# EAGLE design tail (EAGLE 9.3.2)
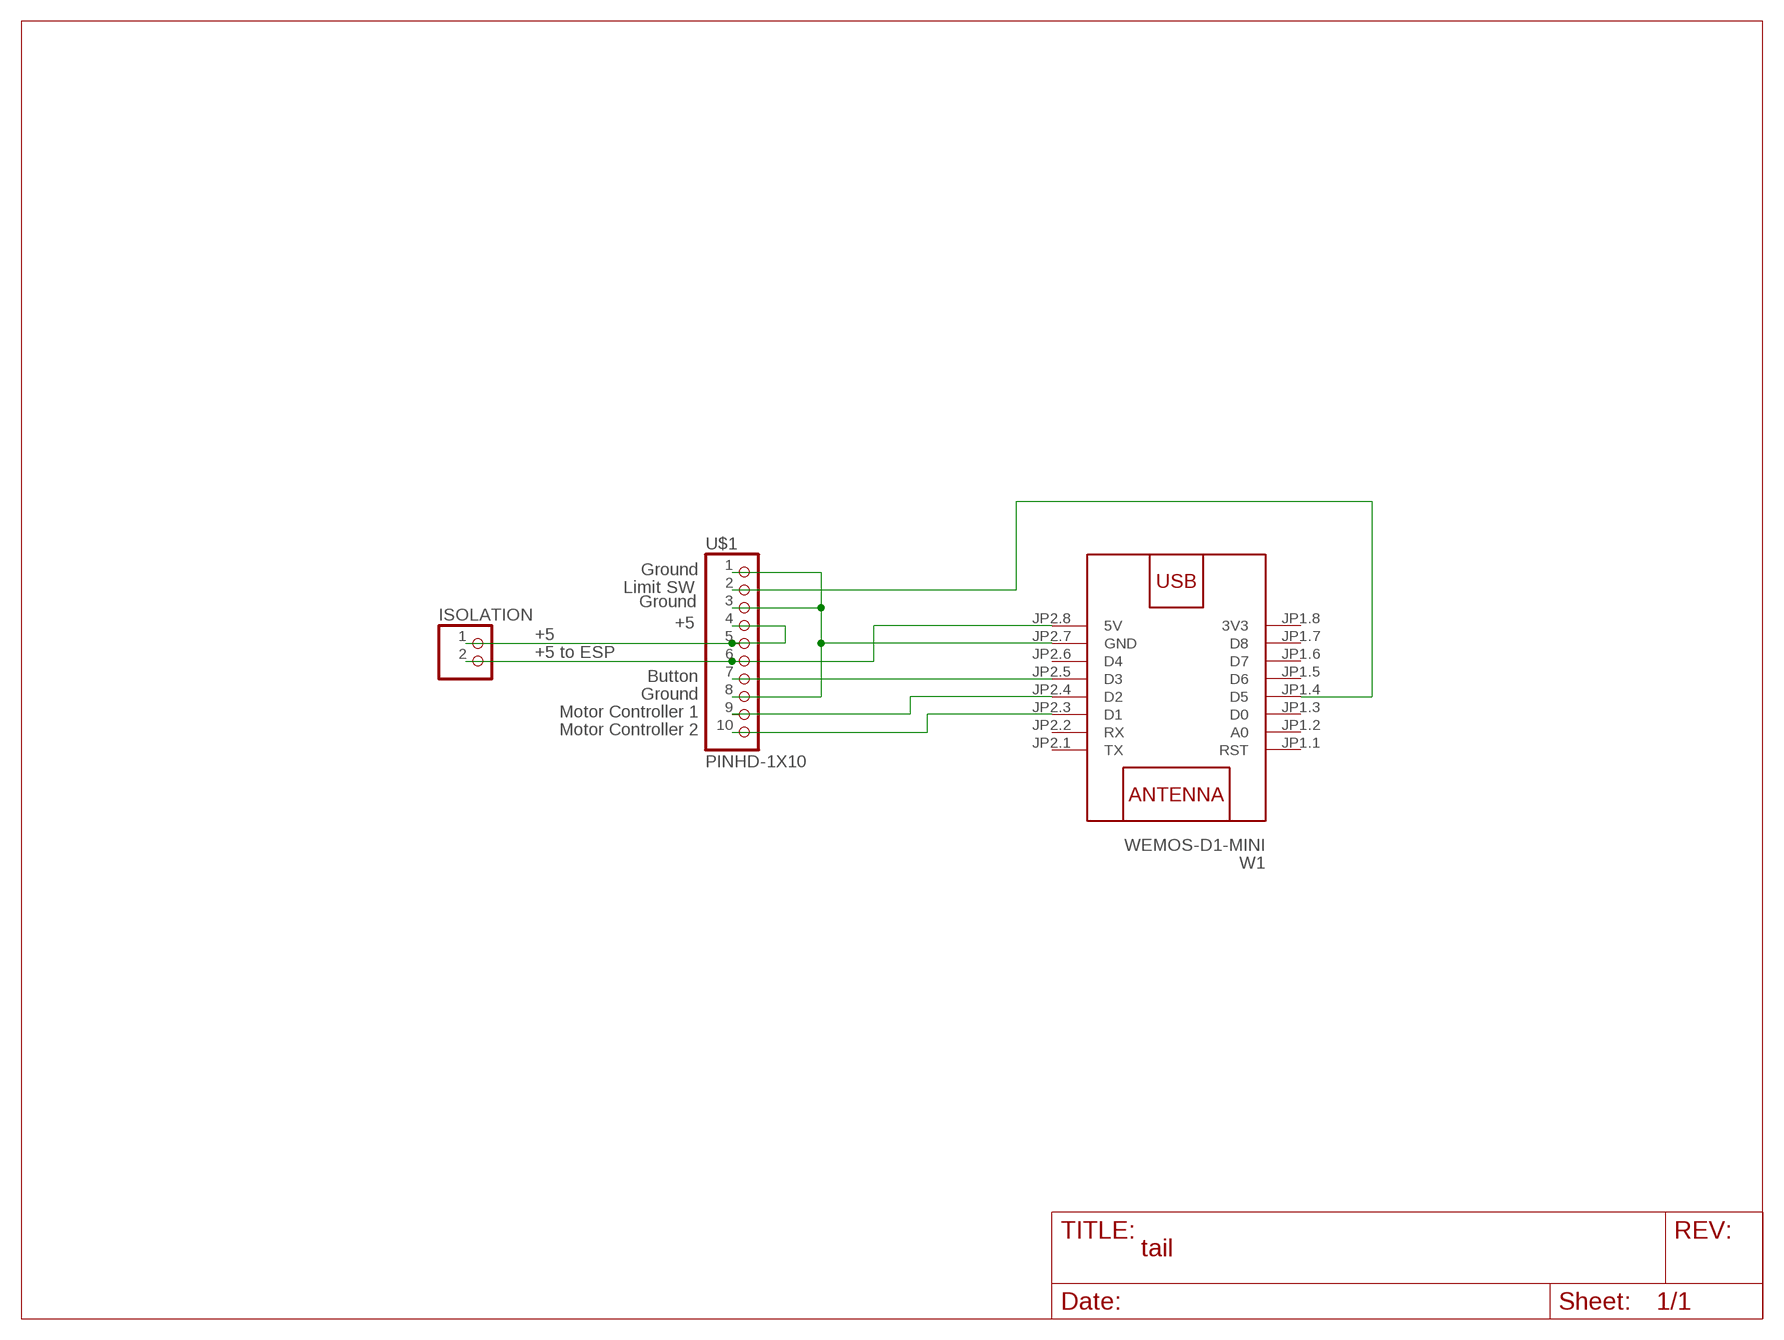
[diagram p0: schematic, sheet 1]

## Parts
ISOLATION  PINHD-1X2  [1X02]
U$1  PINHD-1X10  [1X10-BIG]
W1  WEMOS-D1-MINI  [WEMOS-D1-MINI]

## Nets
N$1: U$1.7 W1.JP2.5(D3)
N$2: U$1.9 W1.JP2.4(D2)
N$3: U$1.10 W1.JP2.3(D1)
N$4: ISOLATION.1 U$1.4 U$1.5
N$6: ISOLATION.2 U$1.6 W1.JP2.8(5V)
N$7: U$1.2 W1.JP1.4(D5)
N$8: U$1.1 U$1.3 U$1.8 W1.JP2.7(GND)
Unconnected: W1.JP1.1(RST) W1.JP1.2(A0) W1.JP1.3(D0) W1.JP1.5(D6) W1.JP1.6(D7) W1.JP1.7(D8) W1.JP2.1(TX) W1.JP2.2(RX) W1.JP2.6(D4)

## Notes on the sheet
- Ground
- Limit SW
- Ground
- +5
- +5
- +5 to ESP
- Button
- Ground
- Motor Controller 1
- Motor Controller 2

## Power pins joined to a net without a drawn wire
3V3: W1.JP1.8(3V3)

## Library data of the parts
ISOLATION = pinhead:PINHD-1X2: PIN HEADER
U$1 = adafruit:PINHD-1X10: Pin header 1x10 0.1" spacing With round pins
W1 = diy-modules:WEMOS-D1-MINI: WEMOS D1 mini: Mini Wi-Fi Board based on ESP-8266 device More details can be found here: https://www.wemos.cc/product/d1-mini.html Click here to find device on ebay.com <http://www.ebay.com/sch/wemos+d1+mini+nodemcu>

## Board
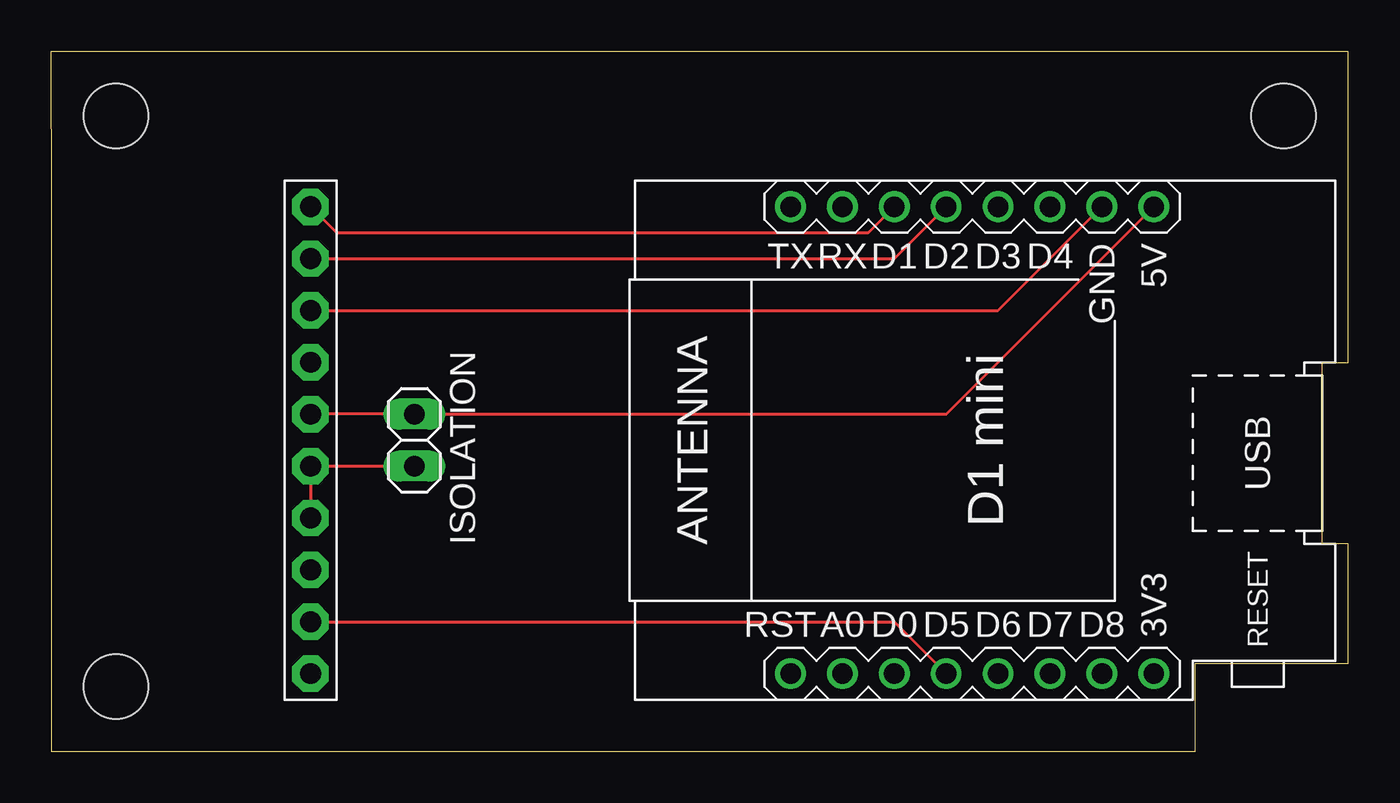
[diagram p1: board, top side]
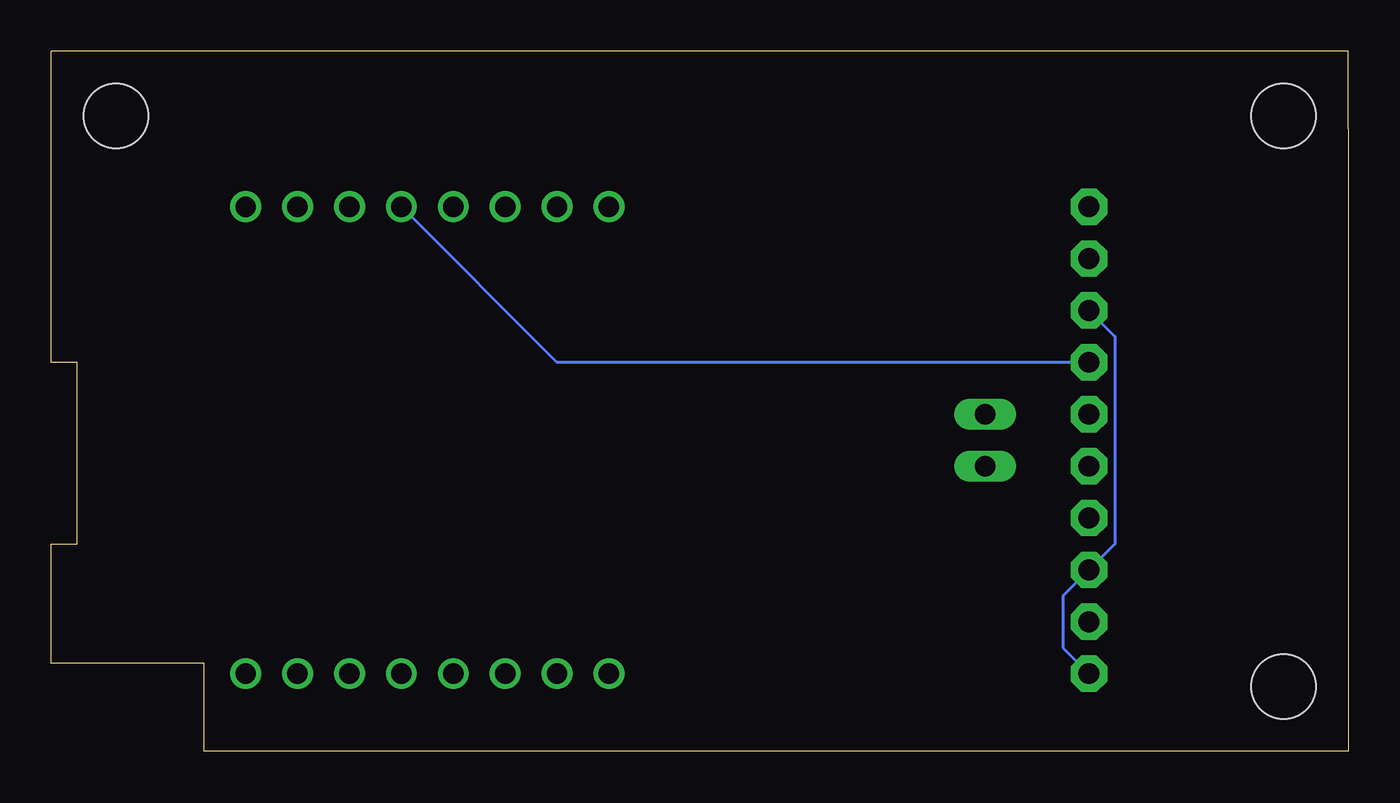
[diagram p2: board, bottom side, seen from below]

Size 63.5 x 34.29 mm. Coordinates in mm from the lower left corner, seen from the top.
Outline: 0,30.47 0,0 56.01,0 56.01,4.32 63.5,4.32 63.5,10.16 62.23,10.16 62.23,19.05 63.5,19.05 63.5,34.29 0,34.29 0,30.48
Copper layers (1*16): Top 0.035mm / dielectric 1.5mm / Bottom 0.035mm
Design rules "default": minimum track width 6mil, minimum drill 0.35mm, track to track 6mil, track to pad 6mil, pad to pad 6mil, via to via 6mil, smd to smd 6mil, copper to edge 40mil, drill to drill 6mil, minimum pad ring 10mil, minimum via ring 8mil, stop-mask expansion 4mil, vias tented up to drill 0mil, thermal gap 10mil
Holes 3.17 mm at 3.17,3.17 3.17,31.11 60.33,31.11

### Footprints (pad centres in the part's own frame; a part is rotated, then mirrored left to right if it is on the bottom)
1X02 = drill 1.016 long: 1 -1.27,0; 2 1.27,0
1X10-BIG = drill 1.016 pad 1.778 octagon: 1 -11.43,0; 2 -8.89,0; 3 -6.35,0; 4 -3.81,0; 5 -1.27,0; 6 1.27,0; 7 3.81,0; 8 6.35,0; 9 8.89,0; 10 11.43,0
WEMOS-D1-MINI = drill 1: JP1.1 -11.43,9.525; JP1.2 -11.43,6.985; JP1.3 -11.43,4.445; JP1.4 -11.43,1.905; JP1.5 -11.43,-0.635; JP1.6 -11.43,-3.175; JP1.7 -11.43,-5.715; JP1.8 -11.43,-8.255; JP2.1 11.43,9.525; JP2.2 11.43,6.985; JP2.3 11.43,4.445; JP2.4 11.43,1.905; JP2.5 11.43,-0.635; JP2.6 11.43,-3.175; JP2.7 11.43,-5.715; JP2.8 11.43,-8.255

### Placement (x,y rotation side)
ISOLATION  17.78,15.24 90 top
U$1  12.7,15.24 90 top
W1  45.72,15.24 90 top

### Tracks (layer width: path | path; a pad name or v marks a point on that pad's centre or on a via)
N$1
  Bottom 0.152: W1.JP2.5 38.73,19.05 U$1.7
N$2
  Top 0.152: W1.JP2.4 41.27,24.13 U$1.9
N$3
  Top 0.152: W1.JP2.3 40.01,25.4 13.97,25.4 U$1.10
N$4
  Top 0.152: ISOLATION.1 U$1.5 U$1.4
N$6
  Top 0.152: W1.JP2.8 43.81,16.51 ISOLATION.2 U$1.6
N$7
  Top 0.152: W1.JP1.4 41.27,6.35 U$1.2
N$8
  Top 0.152: W1.JP2.7 46.35,21.59 U$1.8
  Bottom 0.152: U$1.1 13.97,5.08 13.97,7.62 U$1.3 11.43,10.16 11.43,20.32 U$1.8

### Text on the board
tValues: H-BridgeA | H-BridgeB | G | Button | 5V to ESP | Isolation | +5V in | G | LimitSW | G